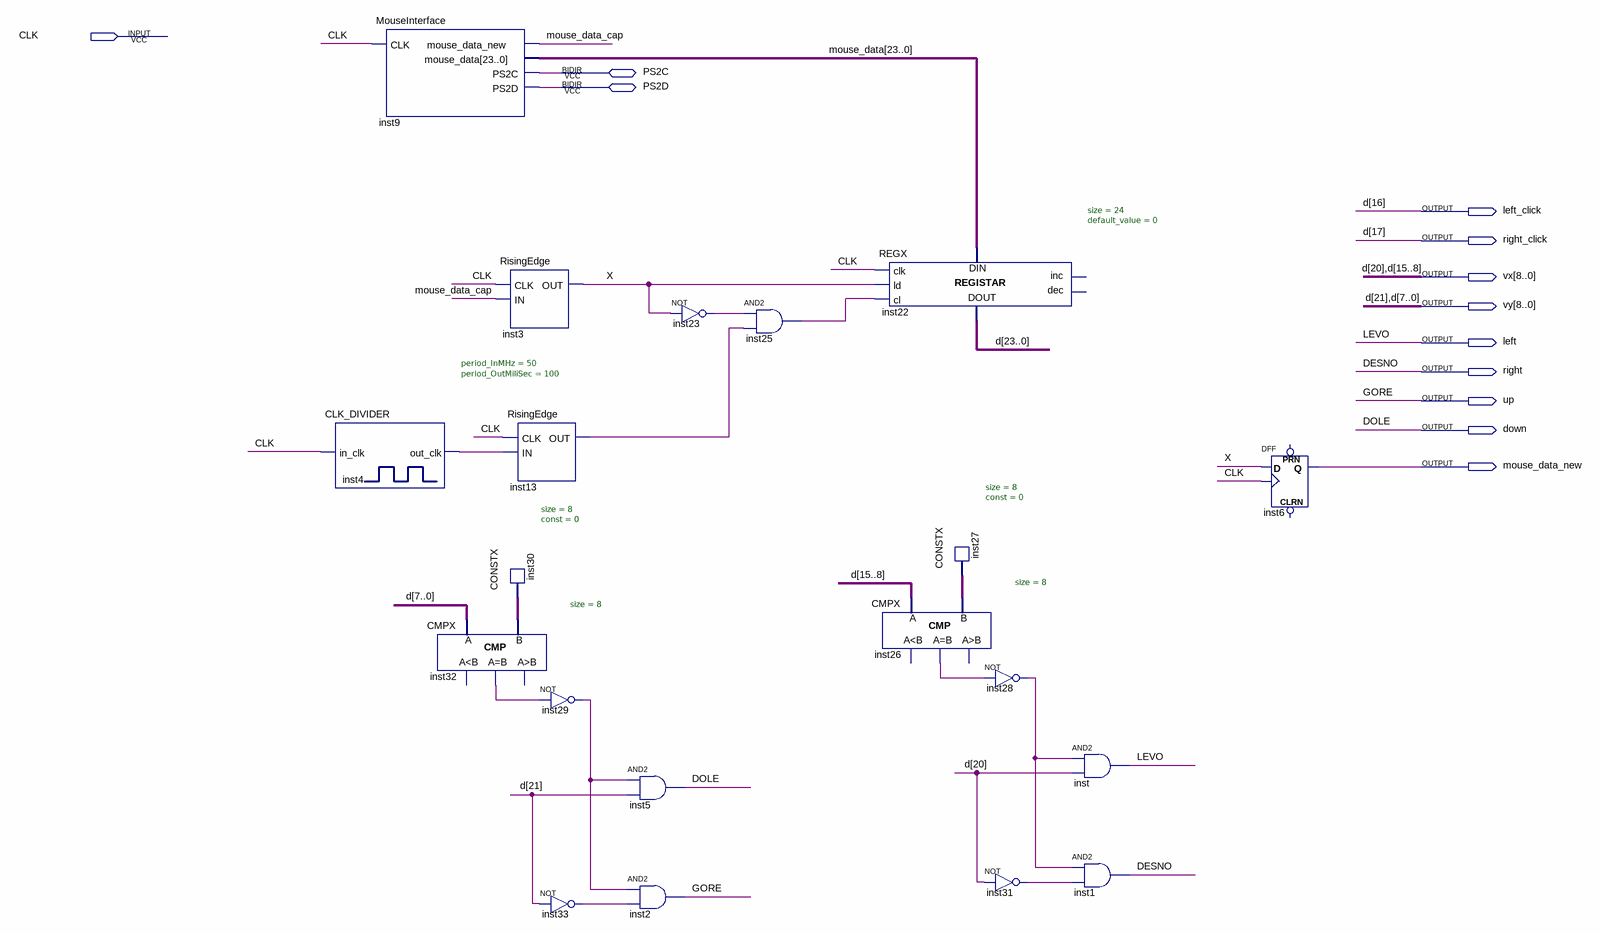
[diagram p0: schematic sheet]
// Quartus schematic mouseController.bdf as structural Verilog: 20 symbols, 12 pins
module mouseController (
  input  CLK,
  inout  PS2C,
  inout  PS2D,
  output left_click,
  output right_click,
  output [8:0] vx,
  output [8:0] vy,
  output left,
  output right,
  output up,
  output down,
  output mouse_data_new
);

  wire inst4_out_clk, inst13_out, inst23_out, inst25_out, inst26_eq, inst28_out, inst29_out, inst31_out,
       inst32_eq, inst33_out, mouse_data_cap, X;
  wire [7:0] inst27_data, inst30_data;
  wire [23:0] mouse_data;
  wire [23:18] d;

  CLK_DIVIDER #(.period_InMHz(50), .period_OutMiliSec(100)) inst4 (.in_clk(CLK), .out_clk(inst4_out_clk));
  MouseInterface inst9 (.CLK(CLK), .mouse_data_new(mouse_data_cap), .mouse_data(mouse_data), .PS2C(PS2C), .PS2D(PS2D));
  CMPX #(.size(8)) inst32 (.A(vy[7:0]), .B(inst30_data), .eq(inst32_eq));  // open: ls, gr
  RisingEdge inst3 (.CLK(CLK), .IN(mouse_data_cap), .OUT(X));
  RisingEdge inst13 (.CLK(CLK), .IN(inst4_out_clk), .OUT(inst13_out));
  CONSTX #(.size(8), .\const (0)) inst30 (.data(inst30_data));
  not inst29 (inst29_out, inst32_eq);
  not inst33 (inst33_out, vy[8]);
  not inst23 (inst23_out, X);
  and inst5 (down, inst29_out, vy[8]);
  and inst2 (up, inst29_out, inst33_out);
  and inst25 (inst25_out, inst23_out, inst13_out);
  REGX #(.size(24), .default_value(0)) inst22 (
    .clk(CLK), .ld(X), .cl(inst25_out), .data_in(mouse_data),
    .data_out({d[23:22], vy[8], vx[8], d[19:18], right_click, left_click, vx[7:0], vy[7:0]}));  // open: inc, dec
  CMPX #(.size(8)) inst26 (.A(vx[7:0]), .B(inst27_data), .eq(inst26_eq));  // open: ls, gr
  CONSTX #(.size(8), .\const (0)) inst27 (.data(inst27_data));
  not inst28 (inst28_out, inst26_eq);
  not inst31 (inst31_out, vx[8]);
  and inst (left, inst28_out, vx[8]);
  and inst1 (right, inst28_out, inst31_out);
  DFF inst6 (.CLK(CLK), .D(X), .Q(mouse_data_new));  // open: CLRN, PRN

  // Other names for the same wires on the sheet: d (some bits) = {vy[8], vx[8], right_click, left_click, vx[7:0], vy[7:0]};
  //   DESNO = right; DOLE = down; GORE = up; LEVO = left
endmodule
